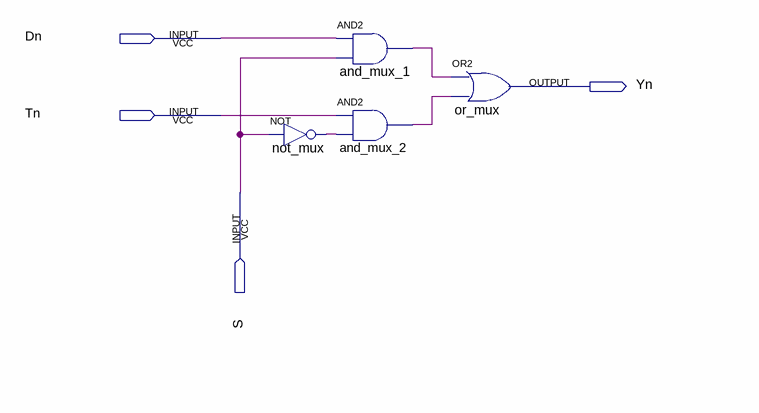
[diagram p0: schematic sheet]
// Quartus schematic mux_2x1.bdf as structural Verilog: 4 symbols, 4 pins
module mux_2x1 (
  input  Dn,
  input  Tn,
  input  S,
  output Yn
);

  wire and_mux_1_out, and_mux_2_out, not_mux_out;

  not not_mux (not_mux_out, S);
  and and_mux_1 (and_mux_1_out, Dn, S);
  and and_mux_2 (and_mux_2_out, Tn, not_mux_out);
  or or_mux (Yn, and_mux_1_out, and_mux_2_out);
endmodule
